# Altium schematic sheet Power.SchDoc
size A3; SheetNumber: 4; SheetTotal: 8
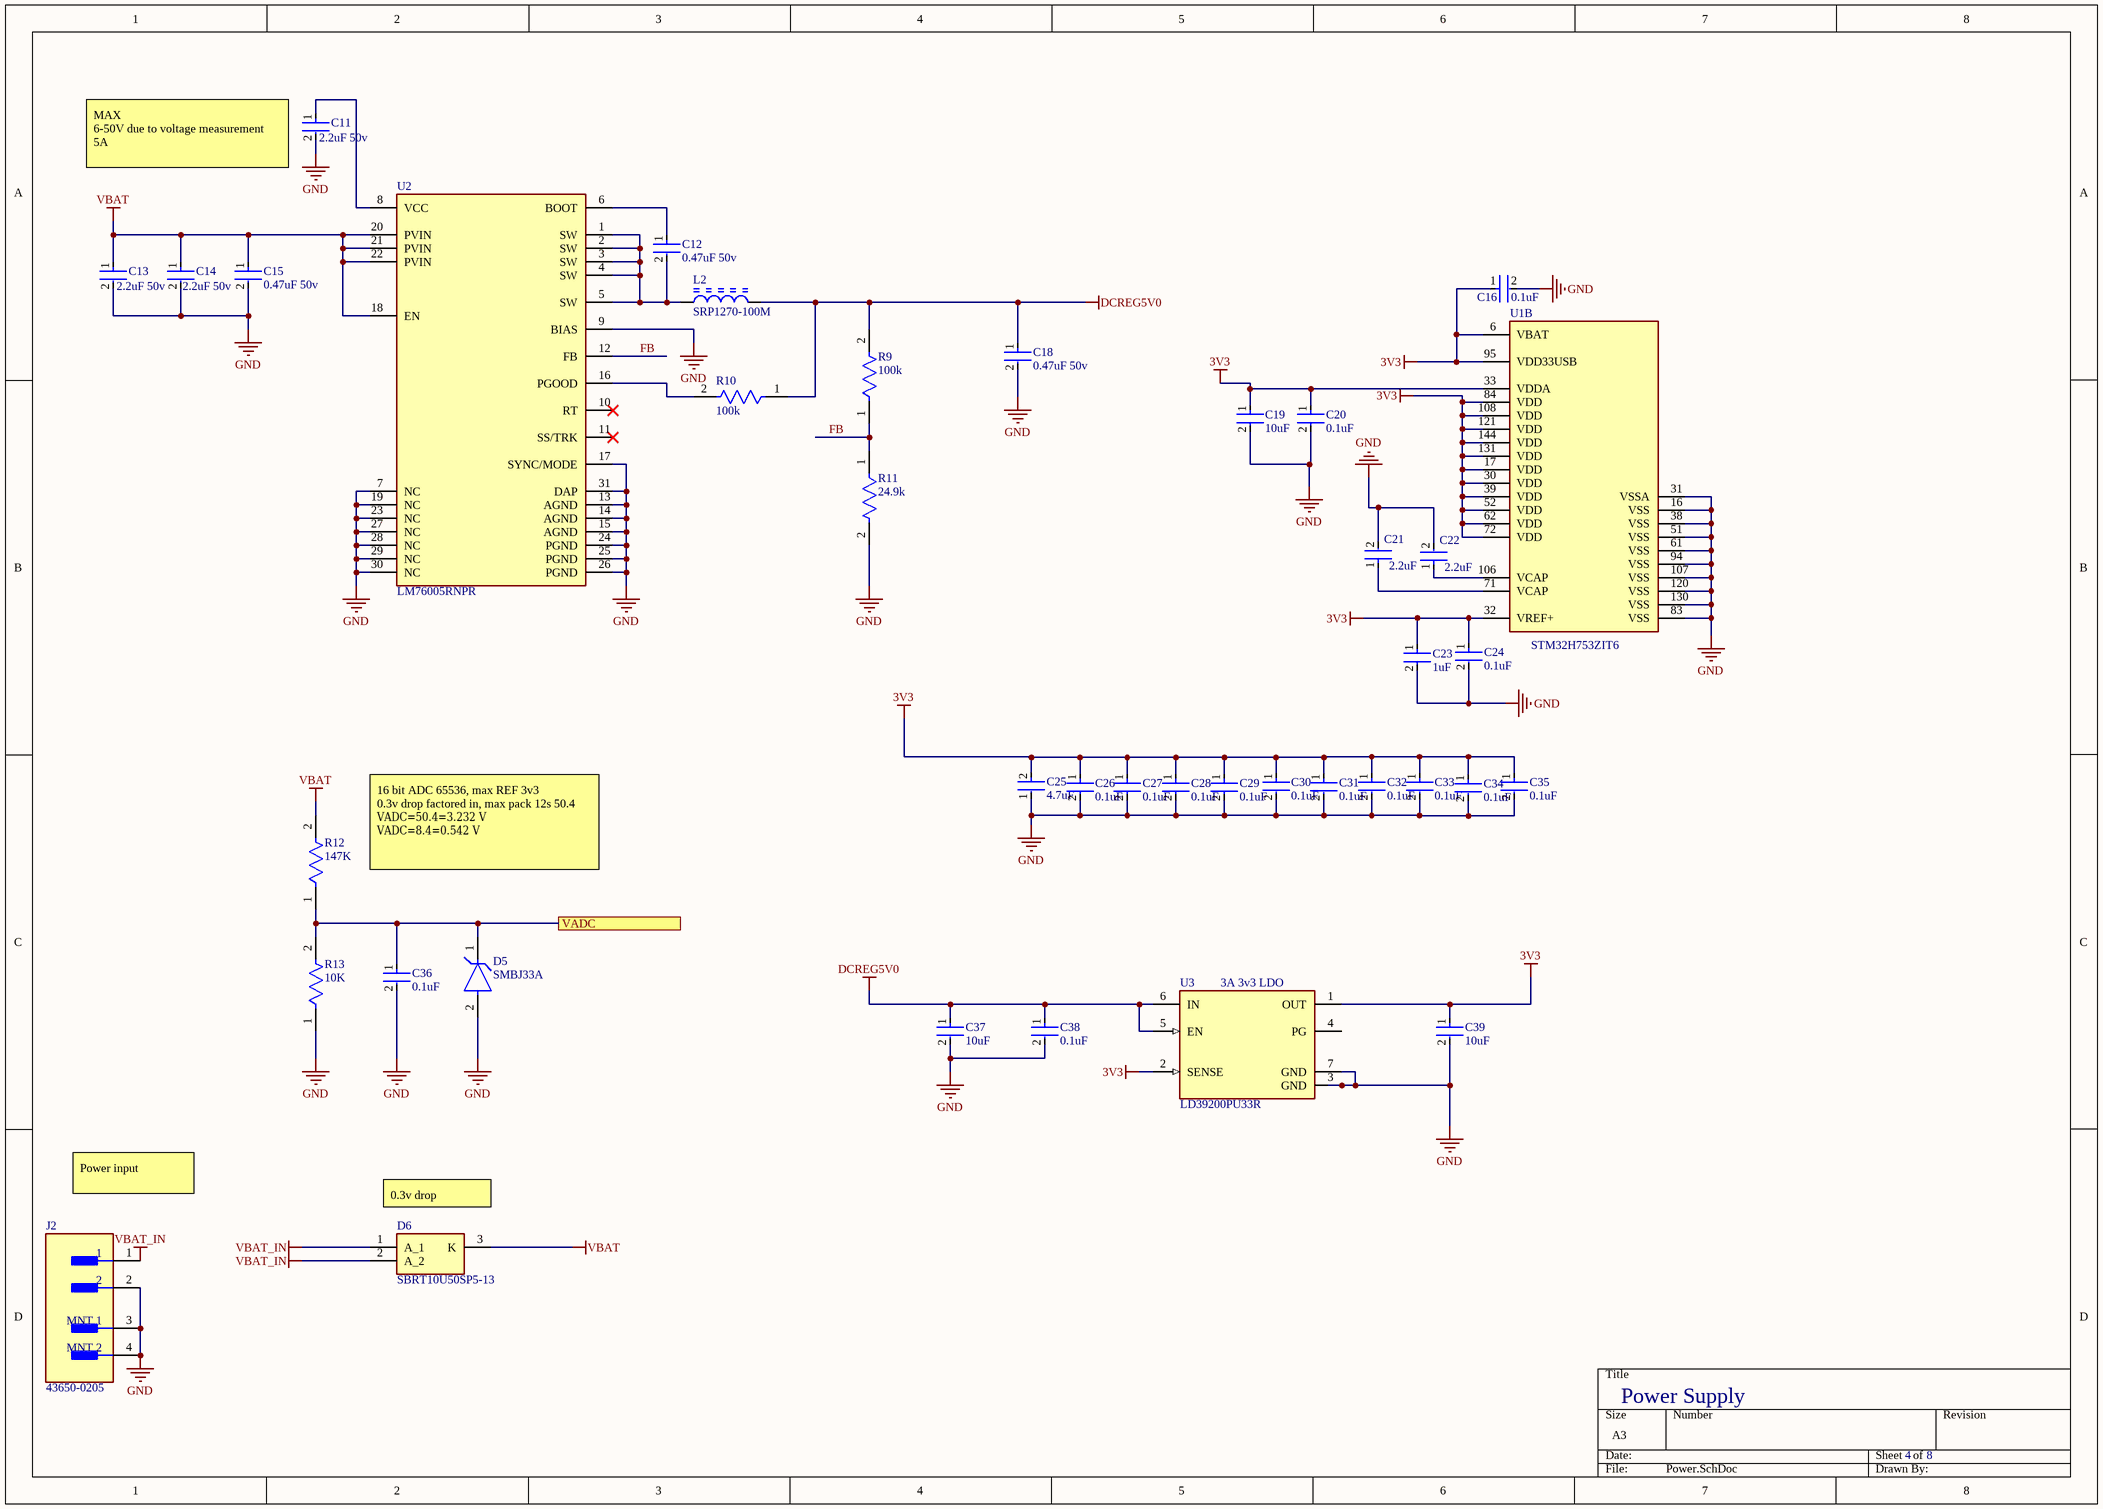
[diagram p0: Power.SchDoc]

## Parts
C11  2.2uF 50v  [FP-GRM188-0_2-IPC_C]
C12  0.47uF 50v  [FP-0603-L_1_6_0_15-W_0_8-MFG]
C13  2.2uF 50v  [FP-GRM188-0_2-IPC_C]
C14  2.2uF 50v  [FP-GRM188-0_2-IPC_C]
C15  0.47uF 50v  [FP-0603-L_1_6_0_15-W_0_8-MFG]
C16  0.1uF  [FP-CL10-IPC_C]
C18  0.47uF 50v  [FP-0603-L_1_6_0_15-W_0_8-MFG]
C19  10uF  [FP-CL10-IPC_C]
C20  0.1uF  [FP-CL10-IPC_C]
C21  2.2uF  [FP-CL10-IPC_C]
C22  2.2uF  [FP-CL10-IPC_C]
C23  1uF  [FP-CL10-IPC_C]
C24  0.1uF  [FP-CL10-IPC_C]
C25  4.7uF  [FP-C1608-080-0_1-MFG]
C26  0.1uF  [FP-CL10-IPC_C]
C27  0.1uF  [FP-CL10-IPC_C]
C28  0.1uF  [FP-CL10-IPC_C]
C29  0.1uF  [FP-CL10-IPC_C]
C30  0.1uF  [FP-CL10-IPC_C]
C31  0.1uF  [FP-CL10-IPC_C]
C32  0.1uF  [FP-CL10-IPC_C]
C33  0.1uF  [FP-CL10-IPC_C]
C34  0.1uF  [FP-CL10-IPC_C]
C35  0.1uF  [FP-CL10-IPC_C]
C36  0.1uF  [FP-CL10-IPC_C]
C37  10uF  [FP-CL10-IPC_C]
C38  0.1uF  [FP-CL10-IPC_C]
C39  10uF  [FP-CL10-IPC_C]
D5  SMBJ33A  [FP-SMBJ-MFG]
D6  SBRT10U50SP5-13  [SBRT10U50SP513]
J2  43650-0205  [FP-43650-0205-MFG]
L2  SRP1270-100M  [BOUR-SRP1270-100M-2_V]
R9  100k  [FP-RC0603-0_55-IPC_C]
R10  100k  [FP-RC0603-0_55-IPC_C]
R11  24.9k  [FP-RG1608-IPC_C]
R12  147K  [FP-RT0603-MFG]
R13  10K  [FP-ERJPB3-IPC_C]
U1  STM32H753ZIT6  [FP-LQFP144-1A-MFG]  (part B of 3)
U2  LM76005RNPR  [FP-RNP0030A-MFG]
U3  LD39200PU33R  [FP-DFN6-7946637-MFG]

## Ports
VADC

## Nets
3V3: C16.1 C19.1 C20.1 C23.1 C24.1 C25.2 C26.1 C27.1 C28.1 C29.1 C30.1 C31.1 C32.1 C33.1 C34.1 C35.1 C39.1 U1.6(VBAT) U1.17(VDD) U1.30(VDD) U1.32(VREF+) U1.33(VDDA) U1.39(VDD) U1.52(VDD) U1.62(VDD) U1.72(VDD) U1.84(VDD) U1.95(VDD33USB) U1.108(VDD) U1.121(VDD) U1.131(VDD) U1.144(VDD) U3.1(OUT) U3.2(SENSE)
DCREG5V0: C18.1 C37.1 C38.1 L2.2 R9.2 R10.1 U3.5(EN) U3.6(IN)
GND: C11.2 C13.2 C14.2 C15.2 C16.2 C18.2 C19.2 C20.2 C21.2 C22.2 C23.2 C24.2 C25.1 C26.2 C27.2 C28.2 C29.2 C30.2 C31.2 C32.2 C33.2 C34.2 C35.2 C36.2 C37.2 C38.2 C39.2 D5.2(A) J2.2 J2.3(MNT_1) J2.4(MNT_2) R11.2 R13.1 U1.16(VSS) U1.31(VSSA) U1.38(VSS) U1.51(VSS) U1.61(VSS) U1.83(VSS) U1.94(VSS) U1.107(VSS) U1.120(VSS) U1.130(VSS) U2.7(NC) U2.9(BIAS) U2.13(AGND) U2.14(AGND) U2.15(AGND) U2.17(SYNC/MODE) U2.19(NC) U2.23(NC) U2.24(PGND) U2.25(PGND) U2.26(PGND) U2.27(NC) U2.28(NC) U2.29(NC) U2.30(NC) U2.31(DAP) U3.3(GND) U3.7(GND)
VBAT: C13.1 C14.1 C15.1 D6.3(K) R12.2 U2.18(EN) U2.20(PVIN) U2.21(PVIN) U2.22(PVIN)
VBAT_IN: D6.1(A_1) D6.2(A_2) J2.1
FB: R9.1 R11.1 U2.12(FB)
VADC: C36.1 D5.1(C) R12.1 R13.2 ; port VADC
NetC11_1: C11.1 U2.8(VCC)
NetC12_1: C12.1 U2.6(BOOT)
NetC12_2: C12.2 L2.1 U2.1(SW) U2.2(SW) U2.3(SW) U2.4(SW) U2.5(SW)
NetC21_1: C21.1 U1.71(VCAP)
NetC22_1: C22.1 U1.106(VCAP)
NetR10_2: R10.2 U2.16(PGOOD)

Not connected (* = marked no-connect by the designer): U2 10(RT)* 11(SS/TRK)*; U3 4(PG)

## Notes on the sheet
- (near C11) MAX
  6-50V due to voltage measurement
  5A
- 16 bit ADC 65536, max REF 3v3
  0.3v drop factored in, max pack 12s 50.4
  VADC​=50.4=3.232 V
  VADC​=8.4=0.542 V
- (near U3) 3A 3v3 LDO
- Power input
- (near D6) 0.3v drop
- Power Supply
- 4
- 8

## Library data of the parts
C11 C13 C14 = CMP-06035-043613-1: GRM188R61H225ME11J Chip Multilayer Ceramic Capacitors for General Purpose, 0603, 2.2uF, X5R, 15%, 20%, 50V
C12 C15 C18 = CMP-14477-000175-2: UMK107ABJ474KA-T; Tolerance: 10%; Dielectric: X5R; Capacitance: 470nF; Packaging: Tape and Reel; Case Code (Metric): 1608; RoHS Compliant: Yes; Depth: 0.8mm; Case/Package: 0603; Length: 1.6mm; Thickness: 0.037inch; Case Code (Imperial): 0603; Radiation Hardening: No; Series: M; Termination: SMD/SMT; Max Operating Temperature: 85°C; Package Quantity: 1; Height: 0.8mm; Voltage: 50V; Width: 0.8mm; Voltage Rating (DC): 50V; Min Operating Temperature: -55°C; Voltage Rating: 50V; Mount: Surface Mount; Lead Free: Lead Free; Construction: Flat
C16 C20 C24 C26-C36 C38 = CMP-13271-002683-1: Cap Ceramic 100nF 16V X7R ±10% Pad SMD 0603 +125°C T/R / CL10B104KO8WPNC; Voltage Rating: 16V; Max Operating Temperature: 125°C; Capacitance: 100nF; Features: Soft Termination; Length: 0.063inch; Packaging: Tape and Reel; Min Operating Temperature: -55°C; Mount: Surface Mount; Case/Package: 0603; Case Code (Metric): 1608; Width: 0.031inch; Ratings: AEC-Q200; Thickness: 0.035inch; Case Code (Imperial): 0603; Tolerance: 10%
C19 C37 C39 = CMP-13271-003287-1: Cap Ceramic 10uF 16V X6S ±20% Pad SMD 0603 +105°C T/R / CL10X106MO8NRNC; Thickness: 0.035inch; Mount: Surface Mount; Length: 0.063inch; Voltage Rating: 16V; Case Code (Imperial): 0603; Case/Package: 0603; Max Operating Temperature: 105°C; Tolerance: 20%; Case Code (Metric): 1608; Width: 0.031inch; Capacitance: 10uF; Min Operating Temperature: -55°C; Packaging: Tape and Reel
C21 C22 = CMP-13271-003360-1: Cap Ceramic 2.2uF 16V X5R ±10% Pad SMD 0603 +85°C T/R / CL10A225KO8NNND; Capacitance: 2.2nF; Depth: 0.8mm; Max Operating Temperature: 85°C; Min Operating Temperature: -55°C; Case/Package: 0603; Packaging: Tape and Reel; Voltage Rating (DC): 16V; Length: 1.6mm; Dielectric: X5R; Radiation Hardening: No; Tolerance: 10%
C23 = CMP-13271-000784-1: Cap Ceramic 1uF 16V X7R ±10% Pad SMD 0603 +125°C T/R / CL10B105KO8NNNL; Mount: Surface Mount; Case/Package: 0603; Capacitance: 1uF; Package Quantity: 15000; Tolerance: 10%; Height: 0.8mm; Thickness: 0.035inch; Length: 1.6mm; Lead Free: Lead Free; Depth: 0.8mm; Radiation Hardening: No; Voltage Rating: 16V; Max Operating Temperature: 125°C; Min Operating Temperature: -55°C; Dielectric: X7R; Voltage Rating (DC): 16V; Packaging: Tape and Reel; Width: 0.031inch
C25 = CMP-08246-005518-1: Multilayer Ceramic Capacitors 4.7μF ±10% 25V X5R SMD 0603 / C1608X5R1E475K080AC; Tolerance: 10%; Series: C; Weight: 7.1E-05oz; RoHS Compliant: Yes; Voltage Rating (DC): 25V; Case/Package: 0603; REACH SVHC: No SVHC; Construction: Flat; Height: 0.8mm; Dielectric: X5R; Case Code (Metric): 1608; Voltage Rating: 25V; Case Code (Imperial): 0603; Min Operating Temperature: -55°C; Lead Free: Lead Free; Dielectric Material: Ceramic; Capacitance: 4.7uF; Packaging: Tape and Reel; Max Operating Temperature: 85°C; Mount: Surface Mount; Termination: SMD/SMT; Width: 0.031inch; Length: 1.6mm; Package Quantity: 4000; Depth: 0.8mm; Resistor Type: Ceramic; Thickness: 0.039inch
D5 = CMP-2000-07095-2: TVS DIODE 33V 53.3V DO214AA; Manufacturer: Littelfuse Inc; Max Junction Temp: +150°C; Number Of Channels: 1; Breakdown Voltage: 36.7V; Peak Pulse Power: 600W; Direction: Unidirectional; Peak Pulse Current: 11.3A; Lead Free: Yes; Height: 2.61mm; Temperature Range Low: -65°C; ComponentLink2URL: https://www.littelfuse.com/~/media/electronics/datasheets/tvs_diodes/littelfuse_tvs_diode_smbj_datasheet.pdf.pdf; Manufacturer Part Number: SMBJ33A; Clamping Voltage: 53.3V; Device Class L1: Circuit Protection; Octopart: https://octopart.com/smbj33a-littelfuse-350829; Device Class L2: TVS Diodes; Digikey Description: TVS DIODE 33V 53.3V DO214AA; Automotive: No; Temperature Range High: +150°C; Package: SMBJ; ComponentLink2Description: Datasheet; Mouser Description: TVS DIODE 33V 53.3V DO214AA; Reverse Standoff Voltage: 33V; Category: Diode; Device Class L3: unset; Temperature: -65°C to +150°C; RoHS: TRUE
D6 = SBRT10U50SP5-13: Diode; Manufacturer_Name: Diodes Incorporated; Datasheet Link: https://www.diodes.com/assets/Datasheets/SBRT10U50SP5.pdf; Height: 1.15mm; Manufacturer_Part_Number: SBRT10U50SP5-13; Mouser Part Number: 621-SBRT10U50SP5-13; Mouser Price/Stock: https://www.mouser.co.uk/ProductDetail/Diodes-Incorporated/SBRT10U50SP5-13?qs=M%2FOdCRO8QQ2p%252BnTDeuohyA%3D%3D; Arrow Part Number: SBRT10U50SP5-13; Arrow Price/Stock: https://www.arrow.com/en/products/sbrt10u50sp5-13/diodes-incorporated
J2 = CMP-00257-07672643-1: 43650-0205 Conn Wire to Board HDR 2 POS 3mm Solder RA Side Entry Thru-Hole Micro-Fit 3.0™ Tray; Manufacturer Lifecycle Status: ACTIVE; Plating: Tin; Glow Wire Compliant: Compliant; Number of Contacts: 2; Gender: Male; Voltage Rating: 600V; Current Rating: 5A; Lifecycle Status: Production; RoHS: Compliant; Number of Rows: 1; Housing Material: Thermoplastic; Country of Origin: US; Number of Circuits: 2; Halogen Free: Low Halogen; Orientation: Right Angle; Termination: Through Hole; Pitch: 3mm; Contact Material: Brass; Contact Plating: Gold; NexarPartId: 7672643; Number of Positions: 2
L2 = CMP-2000-05082-1: Shielded Power Inductor, 10 uH, +/- 20%, 10 A, -55 to 125 degC, 2-Pin SMD, RoHS, Tape and Reel; Manufacturer: Bourns; Type: Wirewound; Material - Core: Iron; 3D Model: SRP1270.stp; EDA / CAD Models: DownloadfromAcceleratedDesigns; Other Names: SRP1270-100M-ND / SRP1270-100MTR / SRP1270100M; Online Catalog: SRPSeries; Frequency - Test: 100kHz; Inductance: 10µH; DC Resistance (DCR): 16.8mOhmMax; Current Rating: 10A; Current - Saturation: 16A; Frequency - Self Resonant: 10MHz; Tolerance: ±20%; Datasheet Version: Dec-12; Package / Case: Nonstandard; Shielding: Shielded; Category: Inductors,Coils,Chokes; RoHS Information: SRP1270SeriesMaterialDeclaration; Operating Temperature: -55degC~125degC; Packaging: Tape&Reel(TR); Datasheet URL: https://datasheet.ciiva.com/11802/0900766b80f2b679-11802877.pdf; Series: SRP1270; Mounting Type: SurfaceMount; Standard Package: 400; Manufacturer URL: http://www.bourns.com/; Height - Seated (Max): 0.276"(7.00mm); Size / Dimension: 0.539"Lx0.539"W(13.70mmx13.70mm); Family: FixedInductors
R9 R10 = CMP-2100-03662-2: RC0603FR-07100KL RES SMD 100K OHM 1% 1/10W 0603; Voltage Rating (DC): 50V; Resistance: 100kR; Max Power Dissipation: 100mW; Temperature Coefficient: 100ppm/°C; Working Voltage: 75V; Length: 1.6mm; Lead Free: Lead Free; Number of Terminations: 2; Packaging: Tape and Reel; Voltage Rating: 50V; Termination: SMD/SMT; Width: 0.8mm; Resistor Type: Thick Film; Resistance Tolerance: 1%; Features: Moisture Resistant; Height: 0.45mm; Construction: Rectangular; Case/Package: 0603; Military Standard: Not; Case Code (Imperial): 0603; Series: RC; Technology: THICK FILM; Depth: 0.8mm; RoHS Compliant: Yes; REACH SVHC: No SVHC; Min Operating Temperature: -55°C; Case Code (Metric): 1608; Max Operating Temperature: 155°C; Power Rating: 100mW; Number of Pins: 2; Tolerance: 1%
R11 = CMP-2000-02140-2: RG1608P-2492-B-T5 / Automotive Metal Thin Film Chip Resistor, 0603, 24.9kΩ, 0.1%, 25ppm/°C, 0.1W, 100V; Power Rating: 100mW; Resistance: 24.9kR; Voltage Rating (DC): 75V; Length: 0.063inch; Case Code (Metric): 1608; Package Quantity: 1; Width: 0.8mm; Case Code (Imperial): 0603; Min Operating Temperature: -55°C; Weight: 7.1E-05oz; Lead Free: Lead Free; Temperature Coefficient: 25ppm/°C; Tolerance: 0.1%; Termination: SMD/SMT; Number of Terminations: 2; Max Operating Temperature: 155°C; RoHS Compliant: Yes; Voltage Rating: 100V; Features: Automotive AEC-Q200; Size Code: 0603; Packaging: Tape and Reel; Series: RG; Resistor Type: Thin Film; Case/Package: 0603; Height: 0.02inch; Max Power Dissipation: 100mW
R12 = CMP-03412-029582-1: RT0603BRD07147KL / RES SMD 147K OHM 0.1% 1/10W 0603; Manufacturer: Yageo; Value: 147KΩ; Tolerance: 0.001; Temperature Coefficient: 25 ppm/°C; Power Rating: 0.1W; Voltage Rating: 75V; ComponentLink2URL: http://www.yageo.com/documents/recent/PYu-RT_1-to-0.01_RoHS_L_9.pdf; Lead Free: Yes; Composition: Thin Film; Octopart: https://octopart.com/rt0603brd07147kl-yageo-1187208; Temperature Range Low: -55°C; Automotive: No; Category: Res; Footprint Url: http://www.yageo.com/exep/pages/download/literatures/PYu-R_Mount_10.pdf; Manufacturer Part Number: RT0603BRD07147KL; Series: RT; Package: RT0603; Ipc Land Pattern Name: RESC16080X45; Digikey Description: RES SMD 147K OHM 0.1% 1/10W 0603; Mouser Description: Res Thin Film 0603 147K Ohm 0.1% 1/10W ±25ppm/°C Molded SMD Paper T/R; Temperature: -55°C to +155°C; RoHS: TRUE; ComponentLink2Description: Datasheet; Height: 0.55mm; Device Class L1: Passive Components; Resistance: 147KΩ; Temperature Range High: +155°C; Device Class L2: Resistors; Device Class L3: Chip SMD Resistors
R13 = CMP-05422-000107-1: ERJ-PB3B1002V / RES SMD 10K OHM 0.1% 1/5W 0603; Max Power Dissipation: 200mW; Temperature Coefficient: 50ppm/°C; Resistance: 10kR; Packaging: Tape and Reel; Max Operating Temperature: 155°C; Length: 0.063inch; Height - Seated (Max): 0.022inch; Case/Package: 0603; Tolerance: 0.1%; Features: Automotive AEC-Q200; Case Code (Imperial): 0603; Number of Terminations: 2; Case Code (Metric): 1608; Min Operating Temperature: -55°C; Width: 0.032inch; Resistor Type: Thick Film
U1 = CMP-12105-000009-1: LQFP 144 20X20X1.4 2; Manufacturer: STMicroelectronics; Number Of Pwm Channels: 24; Number Of I/Os: 114; Number Of Cores: 1; Min Supply Voltage: 1.62V; Interface: I2C,SPI,UART,USART,CAN,USB,LIN,IrDA,Ethernet,I2S,SMBus,Other; Standoff Height: 0.05mm; Number Of I2C Channels: 4; Max Junction Temp: +125°C; Memory Type: FLASH; Ram Size: 1MBytes; Number Of Spi Channels: 6; Core Architecture: ARM Cortex-M7; Number Of Uart Channels: 9; Memory Size: 2MBytes; Number Of Adc Channels: 36; Frequency: 480MHz; Data Bus Width: 32bits; Max Supply Voltage: 3.6V; Number Of Usb Channels: 2; Number Of A/D Converters: 3; Number Of Timers/Counters: 20; Temperature Range High: +125°C; Automotive: No; Mouser Description: MCU 32-Bit STM32 ARM Cortex M7 RISC 2MB Flash 1.8V/2.5V/3.3V 144-Pin LQFP Tray; Device Class L3: Microcontrollers; Height: 1.6mm; Octopart: https://octopart.com/stm32h753zit6-stmicroelectronics-87879771; Device Class L2: Embedded Processors and Controllers; Lead Free: Yes; Category: IC; ComponentLink2URL: https://www.st.com/resource/en/datasheet/stm32h753zi.pdf; Ambient Temperature Range High: +85°C; Number Of Ethernet Channels: 1; Device Class L1: Integrated Circuits (ICs); Ambient Temperature Range Low: -40°C; Package: LQFP144-1A; Temperature Range Low: -40°C; Digikey Description: LQFP 144 20X20X1.4 2; ComponentLink2Description: Datasheet; Temperature: -40°C to +125°C; Manufacturer Part Number: STM32H753ZIT6; RoHS: TRUE
U2 = CMP-04918-000213-1: 3.5-V TO 60-V, 5-A SYNCHRONOUS S; RoHS Compliant: Yes
U3 = CMP-12153-000011-1: IC REG LINEAR 3.3V 2A 6DFN; Number of Outputs: 1; Max Input Voltage: 6V; Output Type: Fixed; Min Input Voltage: 1.25V; Dropout Voltage: 130mV; Operating Supply Current: 1mA; Number of Regulators: 1; Case/Package: DFN; Packaging: Tape and Reel; Output Current: 2A; Min Operating Temperature: -40°C; Mount: Surface Mount; Output Voltage: 3.3V; Max Operating Temperature: 125°C; Lead Free: Lead Free; Package Quantity: 3000